# Altium project GniMp3.PrjPCB
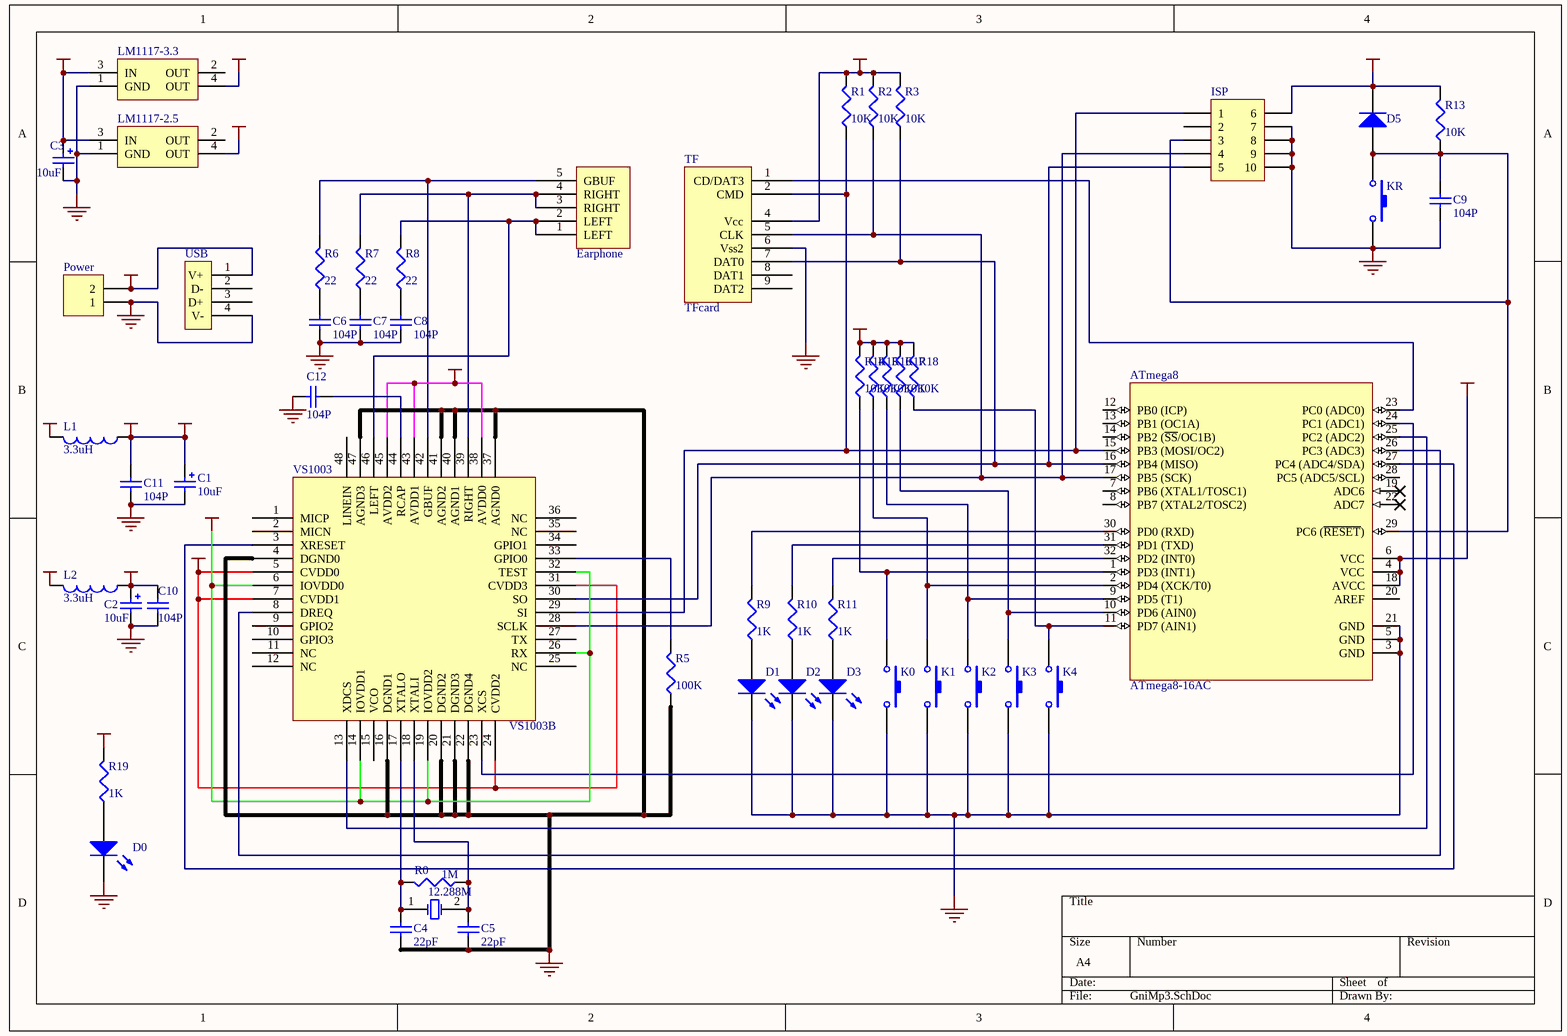
[diagram p0: GniMp3.SchDoc]
1 sheet, 53 parts. Net scope: global (net labels, ports and power ports of the same name join across sheets).
Board file: GniMp3.PcbDoc

## Sheet GniMp3.SchDoc
size A4

### Parts
12.288M  XTAL  [RAD-0.2]  (value not drawn)
ATmega8  ATmega8-16AC  [32A]
C1  value 10uF  [CC3225-1210]  (hidden comment: Cap Pol3)
C2  value 10uF  [CR3225-1210]  (hidden comment: Cap Pol3)
C3  value 10uF  [CR3225-1210]  (hidden comment: Cap Pol3)
C4  value 22pF  [CR2012-0805]  (hidden comment: Cap Semi)
C5  value 22pF  [CR2012-0805]  (hidden comment: Cap Semi)
C6  value 104P  [CR2012-0805]  (hidden comment: Cap Semi)
C7  value 104P  [CR2012-0805]  (hidden comment: Cap Semi)
C8  value 104P  [CR2012-0805]  (hidden comment: Cap Semi)
C9  value 104P  [CR2012-0805]  (hidden comment: Cap Semi)
C10  value 104P  [CR2012-0805]  (hidden comment: Cap Semi)
C11  value 104P  [CR2012-0805]  (hidden comment: Cap Semi)
C12  value 104P  [CR2012-0805]  (hidden comment: Cap Semi)
D0  LED2  [R2012-0805]  (value not drawn)
D1  LED2  [R2012-0805]  (value not drawn)
D2  LED2  [R2012-0805]  (value not drawn)
D3  LED2  [R2012-0805]  (value not drawn)
D5  Diode 1N4148  [DSO-F2/D6.1]  (value not drawn)
Earphone  Earphone  [Earphone]  (value not drawn)
ISP  Header 5X2A  [HDR2X5_CEN]  (value not drawn)
K0  SW-PB  [Key]  (value not drawn)
K1  SW-PB  [Key]  (value not drawn)
K2  SW-PB  [Key]  (value not drawn)
K3  SW-PB  [Key]  (value not drawn)
K4  SW-PB  [Key]  (value not drawn)
KR  SW-PB  [Key]  (value not drawn)
L1  value 3.3uH  [R2012-0805]  (hidden comment: Inductor)
L2  value 3.3uH  [R2012-0805]  (hidden comment: Inductor)
LM1117-2.5  REG1117-5  [ZZ311]  (value not drawn)
LM1117-3.3  REG1117-5  [ZZ311]  (value not drawn)
Power  Header 2  [HDR1X2]  (value not drawn)
R0  value 1M  [R2012-0805]  (hidden comment: Res3)
R1  value 10K  [R2012-0805]  (hidden comment: Res3)
R2  value 10K  [R2012-0805]  (hidden comment: Res3)
R3  value 10K  [R2012-0805]  (hidden comment: Res3)
R5  value 100K  [R2012-0805]  (hidden comment: Res3)
R6  value 22  [R2012-0805]  (hidden comment: Res3)
R7  value 22  [R2012-0805]  (hidden comment: Res3)
R8  value 22  [R2012-0805]  (hidden comment: Res3)
R9  value 1K  [R2012-0805]  (hidden comment: Res3)
R10  value 1K  [R2012-0805]  (hidden comment: Res3)
R11  value 1K  [R2012-0805]  (hidden comment: Res3)
R13  value 10K  [R2012-0805]  (hidden comment: Res3)
R14  value 10K  [R2012-0805]  (hidden comment: Res3)
R15  value 10K  [R2012-0805]  (hidden comment: Res3)
R16  value 10K  [R2012-0805]  (hidden comment: Res3)
R17  value 10K  [R2012-0805]  (hidden comment: Res3)
R18  value 10K  [R2012-0805]  (hidden comment: Res3)
R19  value 1K  [R2012-0805]  (hidden comment: Res3)
TF  TFcard  [TF Card]
USB  USB  [mini_USB]  (value not drawn)
VS1003  VS1003B  [TQFP-48]

### Nets
2.5v: L2.2 LM1117-2.5.4(OUT)
3.3v: ATmega8.4(VCC) ATmega8.6(VCC) ATmega8.18(AVCC) D5.2(K) ISP.6 L1.2 LM1117-3.3.4(OUT) R1.2 R2.2 R3.2 R13.2 R14.2 R15.2 R16.2 R17.2 R18.2 TF.4(Vcc)
AVDD: C1.1 C11.2 L1.1 VS1003.6(IOVDD0) VS1003.14(IOVDD1) VS1003.19(IOVDD2) VS1003.26(RX) VS1003.32(TEST) VS1003.38(AVDD0) VS1003.43(AVDD1) VS1003.45(AVDD2)  [also labelled IOVDD]
CVDD: C2.1 C10.2 L2.1 VS1003.5(CVDD0) VS1003.7(CVDD1) VS1003.24(CVDD2) VS1003.31(CVDD3)
GND: ATmega8.3(GND) ATmega8.5(GND) ATmega8.21(GND) C1.2 C2.2 C3.2 C4.1 C5.2 C6.1 C7.1 C8.1 C9.1 C10.1 C11.1 C12.2 D0.2(K) D1.2(K) D2.2(K) D3.2(K) ISP.7 ISP.8 ISP.9 ISP.10 K0.2 K1.2 K2.2 K3.2 K4.2 KR.2 LM1117-2.5.1(GND) LM1117-3.3.1(GND) Power.1 R5.1 TF.6(Vss2) USB.4(V-) VS1003.4(DGND0) VS1003.16(DGND1) VS1003.20(DGND2) VS1003.21(DGND3) VS1003.22(DGND4) VS1003.37(AGND0) VS1003.40(AGND1) VS1003.41(AGND2) VS1003.47(AGND3)
VCC: C3.1 LM1117-2.5.3(IN) LM1117-3.3.3(IN) Power.2 R19.2 USB.1(V+)
Net12.288M_1: 12.288M.1(OSC1) C4.2 R0.2 VS1003.17(XTALO)
Net12.288M_2: 12.288M.2(OSC2) C5.1 R0.1 VS1003.18(XTALI)
NetATmega8_1: ATmega8.1(PD3_(INT1)) K0.1 R14.1
NetATmega8_2: ATmega8.2(PD4_(XCK/T0)) K1.1 R15.1
NetATmega8_9: ATmega8.9(PD5_(T1)) K2.1 R16.1
NetATmega8_10: ATmega8.10(PD6_(AIN0)) K3.1 R17.1
NetATmega8_11: ATmega8.11(PD7_(AIN1)) K4.1 R18.1
NetATmega8_15: ATmega8.15(PB3_(MOSI/OC2)) ISP.1 R1.1 TF.2(CMD) VS1003.29(SI)
NetATmega8_16: ATmega8.16(PB4_(MISO)) ISP.5 R3.1 TF.7(DAT0) VS1003.30(SO)
NetATmega8_17: ATmega8.17(PB5_(SCK)) ISP.4 R2.1 TF.5(CLK) VS1003.28(SCLK)
NetATmega8_23: ATmega8.23(PC0_(ADC0)) TF.1(CD/DAT3)
NetATmega8_24: ATmega8.24(PC1_(ADC1)) VS1003.23(XCS)
NetATmega8_25: ATmega8.25(PC2_(ADC2)) VS1003.13(XDCS)
NetATmega8_26: ATmega8.26(PC3_(ADC3)) VS1003.8(DREQ)
NetATmega8_27: ATmega8.27(PC4_(ADC4/SDA)) VS1003.3(XRESET)
NetATmega8_29: ATmega8.29(PC6_(~{RESET})) C9.2 D5.1(A) ISP.3 KR.1 R13.1
NetATmega8_30: ATmega8.30(PD0_(RXD)) R9.2
NetATmega8_31: ATmega8.31(PD1_(TXD)) R10.2
NetATmega8_32: ATmega8.32(PD2_(INT0)) R11.2
NetC6_2: C6.2 R6.1
NetC7_2: C7.2 R7.1
NetC8_2: C8.2 R8.1
NetC12_1: C12.1 VS1003.44(RCAP)
NetD0_1: D0.1(A) R19.1
NetD1_1: D1.1(A) R9.1
NetD2_1: D2.1(A) R10.1
NetD3_1: D3.1(A) R11.1
NetEarphone_1: Earphone.1(LEFT) Earphone.2(LEFT) R8.2 VS1003.46(LEFT)
NetEarphone_3: Earphone.3(RIGHT) Earphone.4(RIGHT) R7.2 VS1003.39(RIGHT)
NetEarphone_5: Earphone.5(GBUF) R6.2 VS1003.42(GBUF)
NetR5_2: R5.2 VS1003.33(GPIO0)

Not connected (* = marked no-connect by the designer): ATmega8 7(PB6_(XTAL1/TOSC1)) 8(PB7_(XTAL2/TOSC2)) 12(PB0_(ICP)) 13(PB1_(OC1A)) 14(PB2_(~{SS}/OC1B)) 19(ADC6)* 20(AREF) 22(ADC7)* 28(PC5_(ADC5/SCL)); ISP 2; LM1117-2.5 2(OUT); LM1117-3.3 2(OUT); TF 8(DAT1) 9(DAT2); USB 2(D-) 3(D+); VS1003 1(MICP) 2(MICN) 9(GPIO2) 10(GPIO3) 11(NC) 12(NC) 15(VCO) 25(NC) 27(TX) 34(GPIO1) 35(NC) 36(NC) 48(LINEIN)

### Library data of the parts
12.288M = XTAL: Crystal Oscillator; Published: 8-Jun-2000; Revision: July-2002: Re-released for DXP Platform.; Publisher: Altium Limited
ATmega8 = ATmega8-16AC: 8-Bit AVR Microcontroller with 8K Bytes of In-System Programmable Flash Memory; Package Information: Latest Revision: revB, Oct-2001; Code - JEDEC: MS-026-ABA; Published: 17-Sep-2003; Datasheet: Latest Revision: 2486H-AVR-09/02; Package Reference: 32A; Publisher: Altium Limited
C1-C3 = Cap Pol3: Polarized Capacitor (Surface Mount); Published: 8-Jun-2000; Revision: July-2002: Re-released for DXP Platform.; Publisher: Altium Limited
C4-C12 = Cap Semi: Capacitor (Semiconductor SIM Model); Published: 8-Jun-2000; Revision: July-2002: Re-released for DXP Platform.; Publisher: Altium Limited
D0-D3 = LED2: Typical RED, GREEN, YELLOW, AMBER GaAs LED; Published: 8-Jun-2000; Revision: July-2002: Re-released for DXP Platform.; Publisher: Altium Limited
D5 = Diode 1N4148: High Conductance Fast Diode; Revision 1: 11-Jul-2000: SIM Model Added.; Revision 2: 17-Jul-2002: Re-released for DXP Platform.; Code - JEDEC: DO-204-AH; Published: 8-Jun-2000; Datasheet: Latest Revision: 1997; Package Reference: DO-35; Publisher: Altium Limited
ISP = Header 5X2A: Header, 5-Pin, Dual row; Revision: 17-Jul-2002: Re-released for DXP Platform.; Publisher: Altium Limited
K0-K4 KR = SW-PB: Switch; Published: 24-Mar-1999; Revision: July-2002: Re-released for DXP Platform.; Publisher: Altium Limited
LM1117-2.5 LM1117-3.3 = REG1117-5: 800mA and 1A Low Dropout Positive Regulator 2.85V, 3.3V, 5V, and Adjustable; Package Information: Latest Revision: revC; Published: 8-Jun-2000; Revision: 17-Jul-2002: Re-released for DXP Platform.; Datasheet: Latest Revision: Sep-1997; Package Reference: ZZ311; Publisher: Altium Limited
Power = Header 2: Header, 2-Pin; Revision: 17-Jul-2002: Re-released for DXP Platform.; Publisher: Altium Limited
R0-R3 R5-R11 R13-R19 = Res3: Resistor; Published: 8-Jun-2000; Revision: July-2002: Re-released for DXP Platform.; Publisher: Altium Limited
L1 L2 = Inductor: Published: 8-Jun-2000; Revision: July-2002: Re-released for DXP Platform.; Publisher: Altium Limited